# Altium project KVision_V1I1.PrjPcb (part 2 of 2)
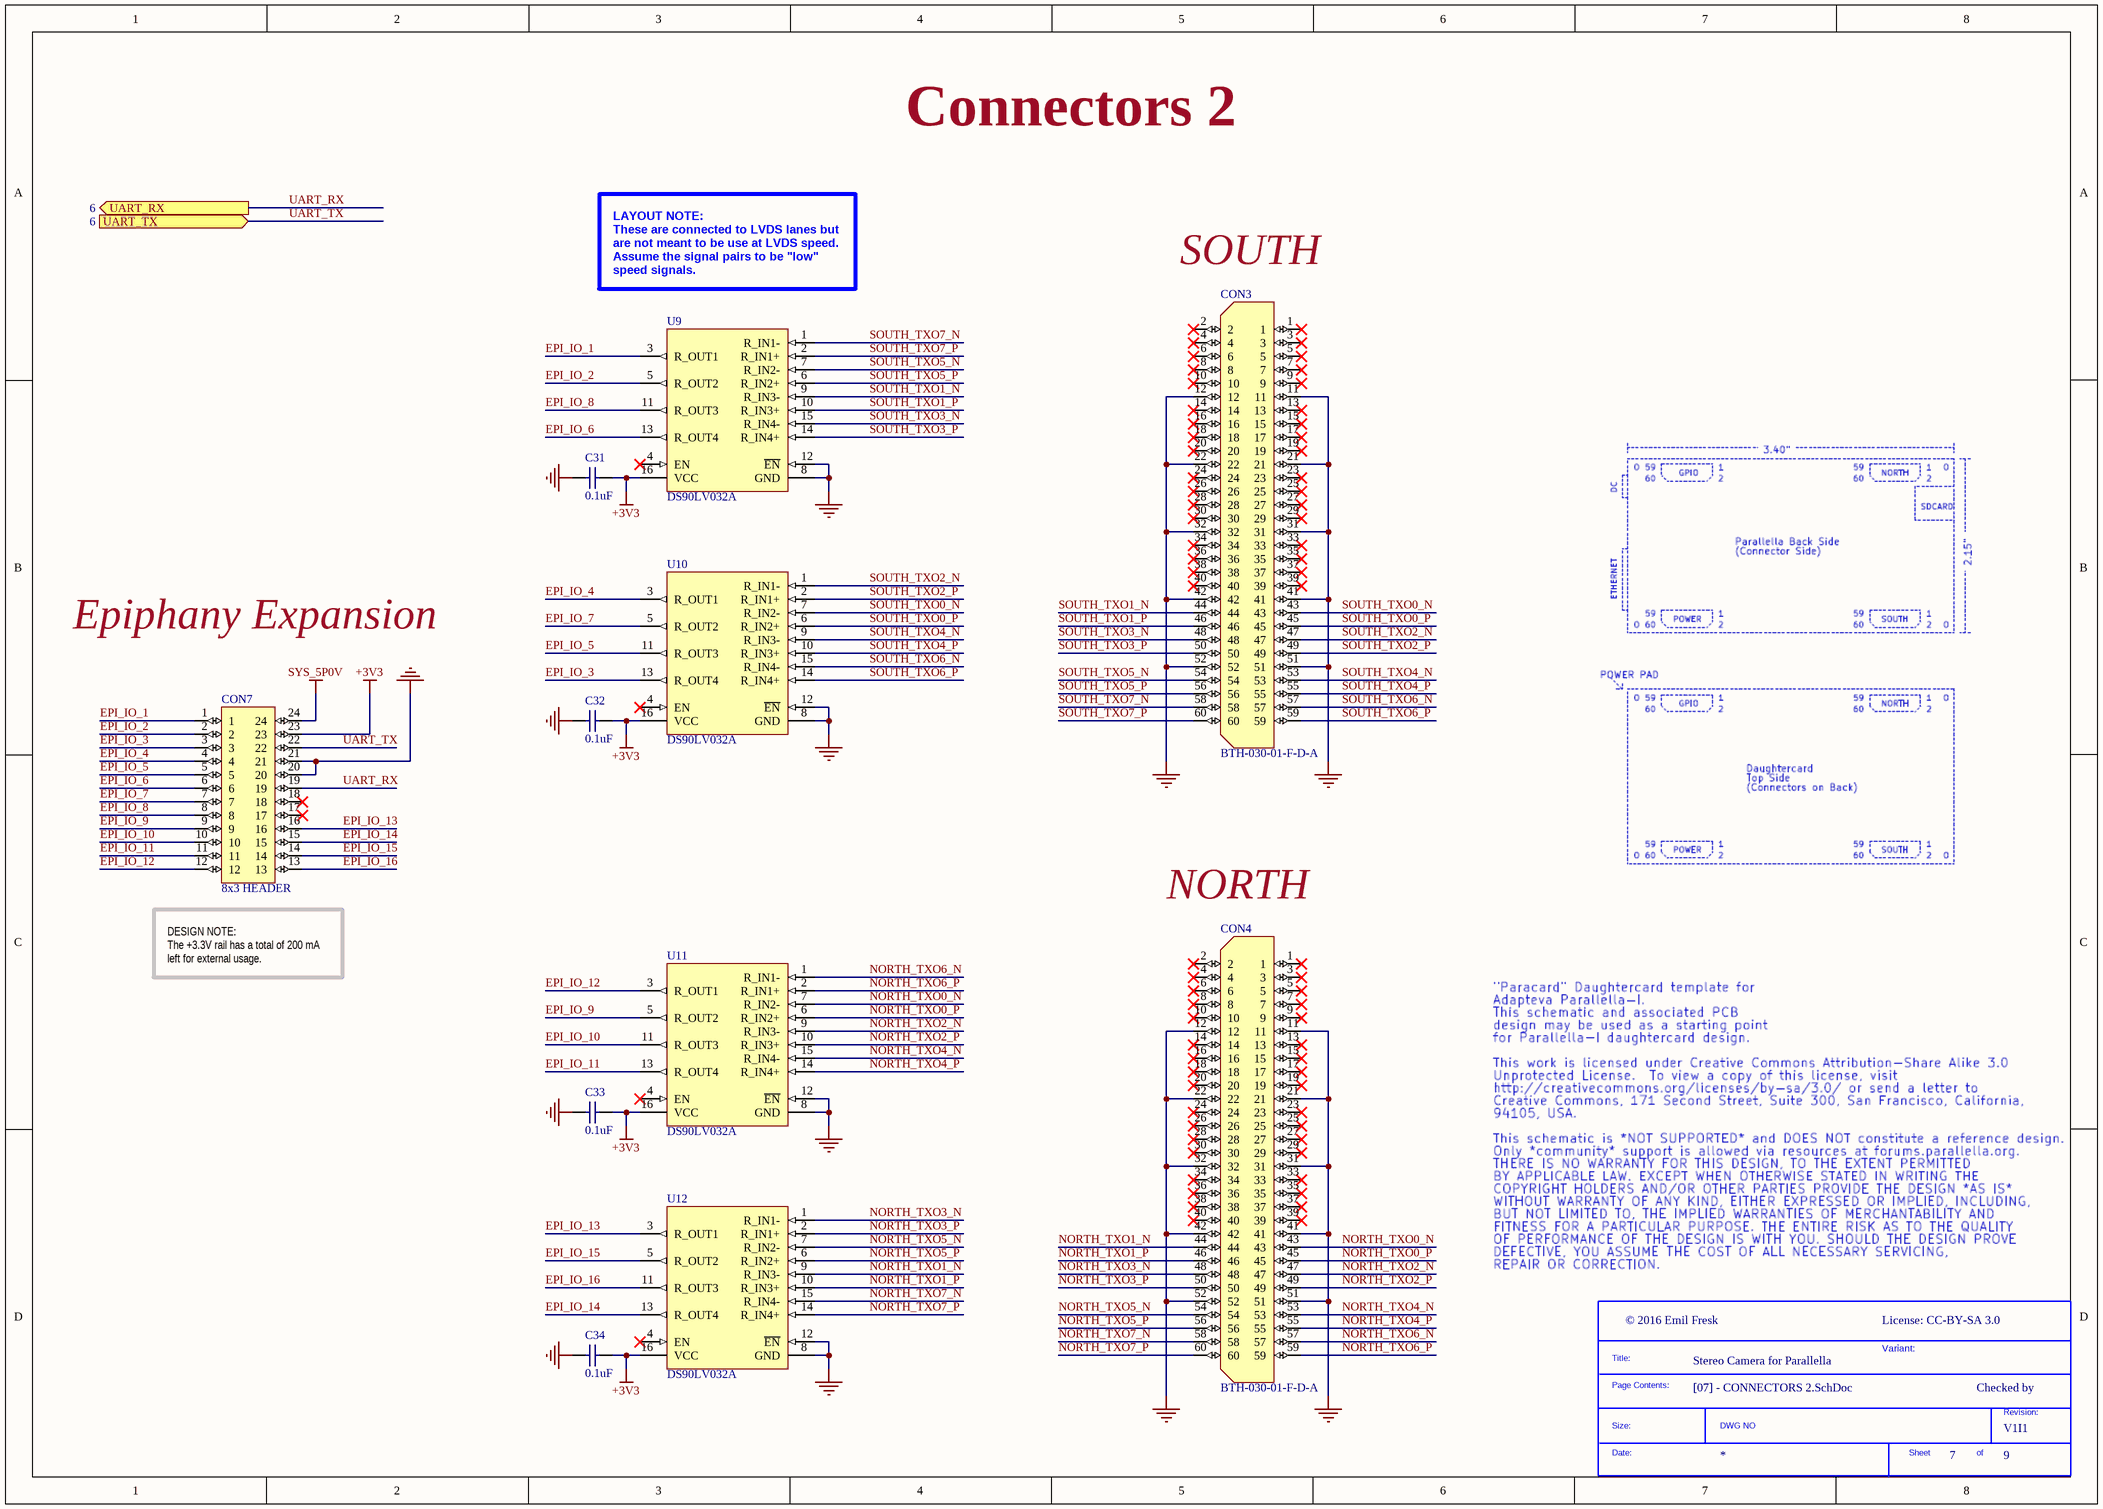
[diagram p9: [07] - CONNECTORS 2.SchDoc]

## Nets that join several sheets
+3V3: [03] - POWER (C2.1 C3.1 L1.2 U1.4), [04] - IMAGE SENSORS (23 pins), [06] - CONNECTORS 1 (5 pins), [07] - CONNECTORS 2 (9 pins)
GND: [03] - POWER (8 pins), [04] - IMAGE SENSORS (37 pins), [05] - IMU (16 pins), [06] - CONNECTORS 1 (48 pins), [07] - CONNECTORS 2 (34 pins)
SYS_5P0V: [03] - POWER (F1.1), [06] - CONNECTORS 1 (CON2.1 CON2.2 CON5.24), [07] - CONNECTORS 2 (CON7.24)
VAA: [03] - POWER (C6.1 U2.5), [04] - IMAGE SENSORS (FB2.1 FB3.1), [05] - IMU (FB4.1)
VDD_GPIO: [05] - IMU (5 pins), [06] - CONNECTORS 1 (CON1.1 CON1.2 CON5.20 TP20.1)
CAM1_CLK_N: [04] - IMAGE SENSORS (U3.2), [06] - CONNECTORS 1 (CON1.4)
CAM1_CLK_P: [04] - IMAGE SENSORS (U3.3), [06] - CONNECTORS 1 (CON1.6)
CAM1_DATA_N: [04] - IMAGE SENSORS (U3.5), [06] - CONNECTORS 1 (CON1.8)
CAM1_DATA_P: [04] - IMAGE SENSORS (U3.4), [06] - CONNECTORS 1 (CON1.10)
CAM1_EXPOSURE: [04] - IMAGE SENSORS (TP5.1 U3.23), [06] - CONNECTORS 1 (R9.2)
CAM1_LED_OUT: [04] - IMAGE SENSORS (U3.27), [06] - CONNECTORS 1 (CON5.22 R14.1)
CAM1_SYSCLK: [04] - IMAGE SENSORS (TP7.1 U3.47), [06] - CONNECTORS 1 (R9.1)
CAM2_CLK_N: [04] - IMAGE SENSORS (U4.2), [06] - CONNECTORS 1 (CON1.3)
CAM2_CLK_P: [04] - IMAGE SENSORS (U4.3), [06] - CONNECTORS 1 (CON1.5)
CAM2_DATA_N: [04] - IMAGE SENSORS (U4.5), [06] - CONNECTORS 1 (CON1.7)
CAM2_DATA_P: [04] - IMAGE SENSORS (U4.4), [06] - CONNECTORS 1 (CON1.9)
CAM2_EXPOSURE: [04] - IMAGE SENSORS (TP10.1 U4.23), [06] - CONNECTORS 1 (R9.4)
CAM2_LED_OUT: [04] - IMAGE SENSORS (U4.27), [06] - CONNECTORS 1 (CON5.19 R12.1)
CAM2_SYSCLK: [04] - IMAGE SENSORS (TP11.1 U4.47), [06] - CONNECTORS 1 (R9.3)
CAM_RESET#: [04] - IMAGE SENSORS (7 pins), [06] - CONNECTORS 1 (U7.6)
CAM_STANDBY: [04] - IMAGE SENSORS (TP2.1 U3.33 U4.33), [06] - CONNECTORS 1 (U7.3)
CFG_SCLK: [04] - IMAGE SENSORS (TP4.1 U3.25 U4.25), [06] - CONNECTORS 1 (CON2.3)
CFG_SDA: [04] - IMAGE SENSORS (TP3.1 U3.24 U4.24), [06] - CONNECTORS 1 (CON2.4)
IMU_CS: [05] - IMU (TP15.1 U5.12), [06] - CONNECTORS 1 (CON1.19)
IMU_INT: [05] - IMU (TP16.1 U5.4), [06] - CONNECTORS 1 (CON1.17)
IMU_SCLK: [05] - IMU (TP12.1 U5.13), [06] - CONNECTORS 1 (CON1.28)
IMU_SDI: [05] - IMU (TP13.1 U5.14), [06] - CONNECTORS 1 (CON1.25)
IMU_SDO: [05] - IMU (TP14.1 U5.1), [06] - CONNECTORS 1 (CON1.23)
MTI_RX: [05] - IMU (TP18.1 U6.23), [06] - CONNECTORS 1 (CON1.36)
MTI_SYNC: [05] - IMU (TP17.1 U6.16), [06] - CONNECTORS 1 (CON1.29)
MTI_TX: [05] - IMU (TP19.1 U6.24), [06] - CONNECTORS 1 (CON1.34)
UART_RX: [06] - CONNECTORS 1 (CON2.24), [07] - CONNECTORS 2 (CON7.19)
UART_TX: [06] - CONNECTORS 1 (CON2.26), [07] - CONNECTORS 2 (CON7.22)